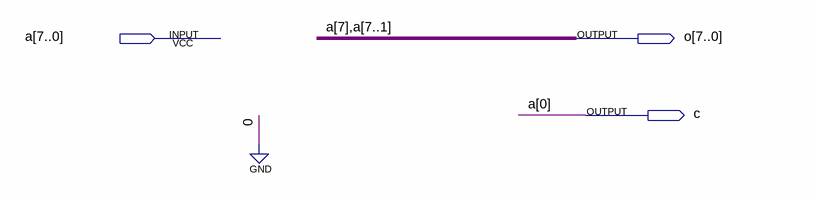
[diagram p0: schematic sheet]
// Quartus schematic AR_SR8.bdf as structural Verilog: 0 symbols, 3 pins
module AR_SR8 (
  input  [7:0] a,
  output [7:0] o,
  output c
);


  assign c = a[0];
  assign o = {{2{a[7]}}, a[6:1]};
endmodule
